# Altium schematic sheet Teensywpinsfinal.SchDoc
size C
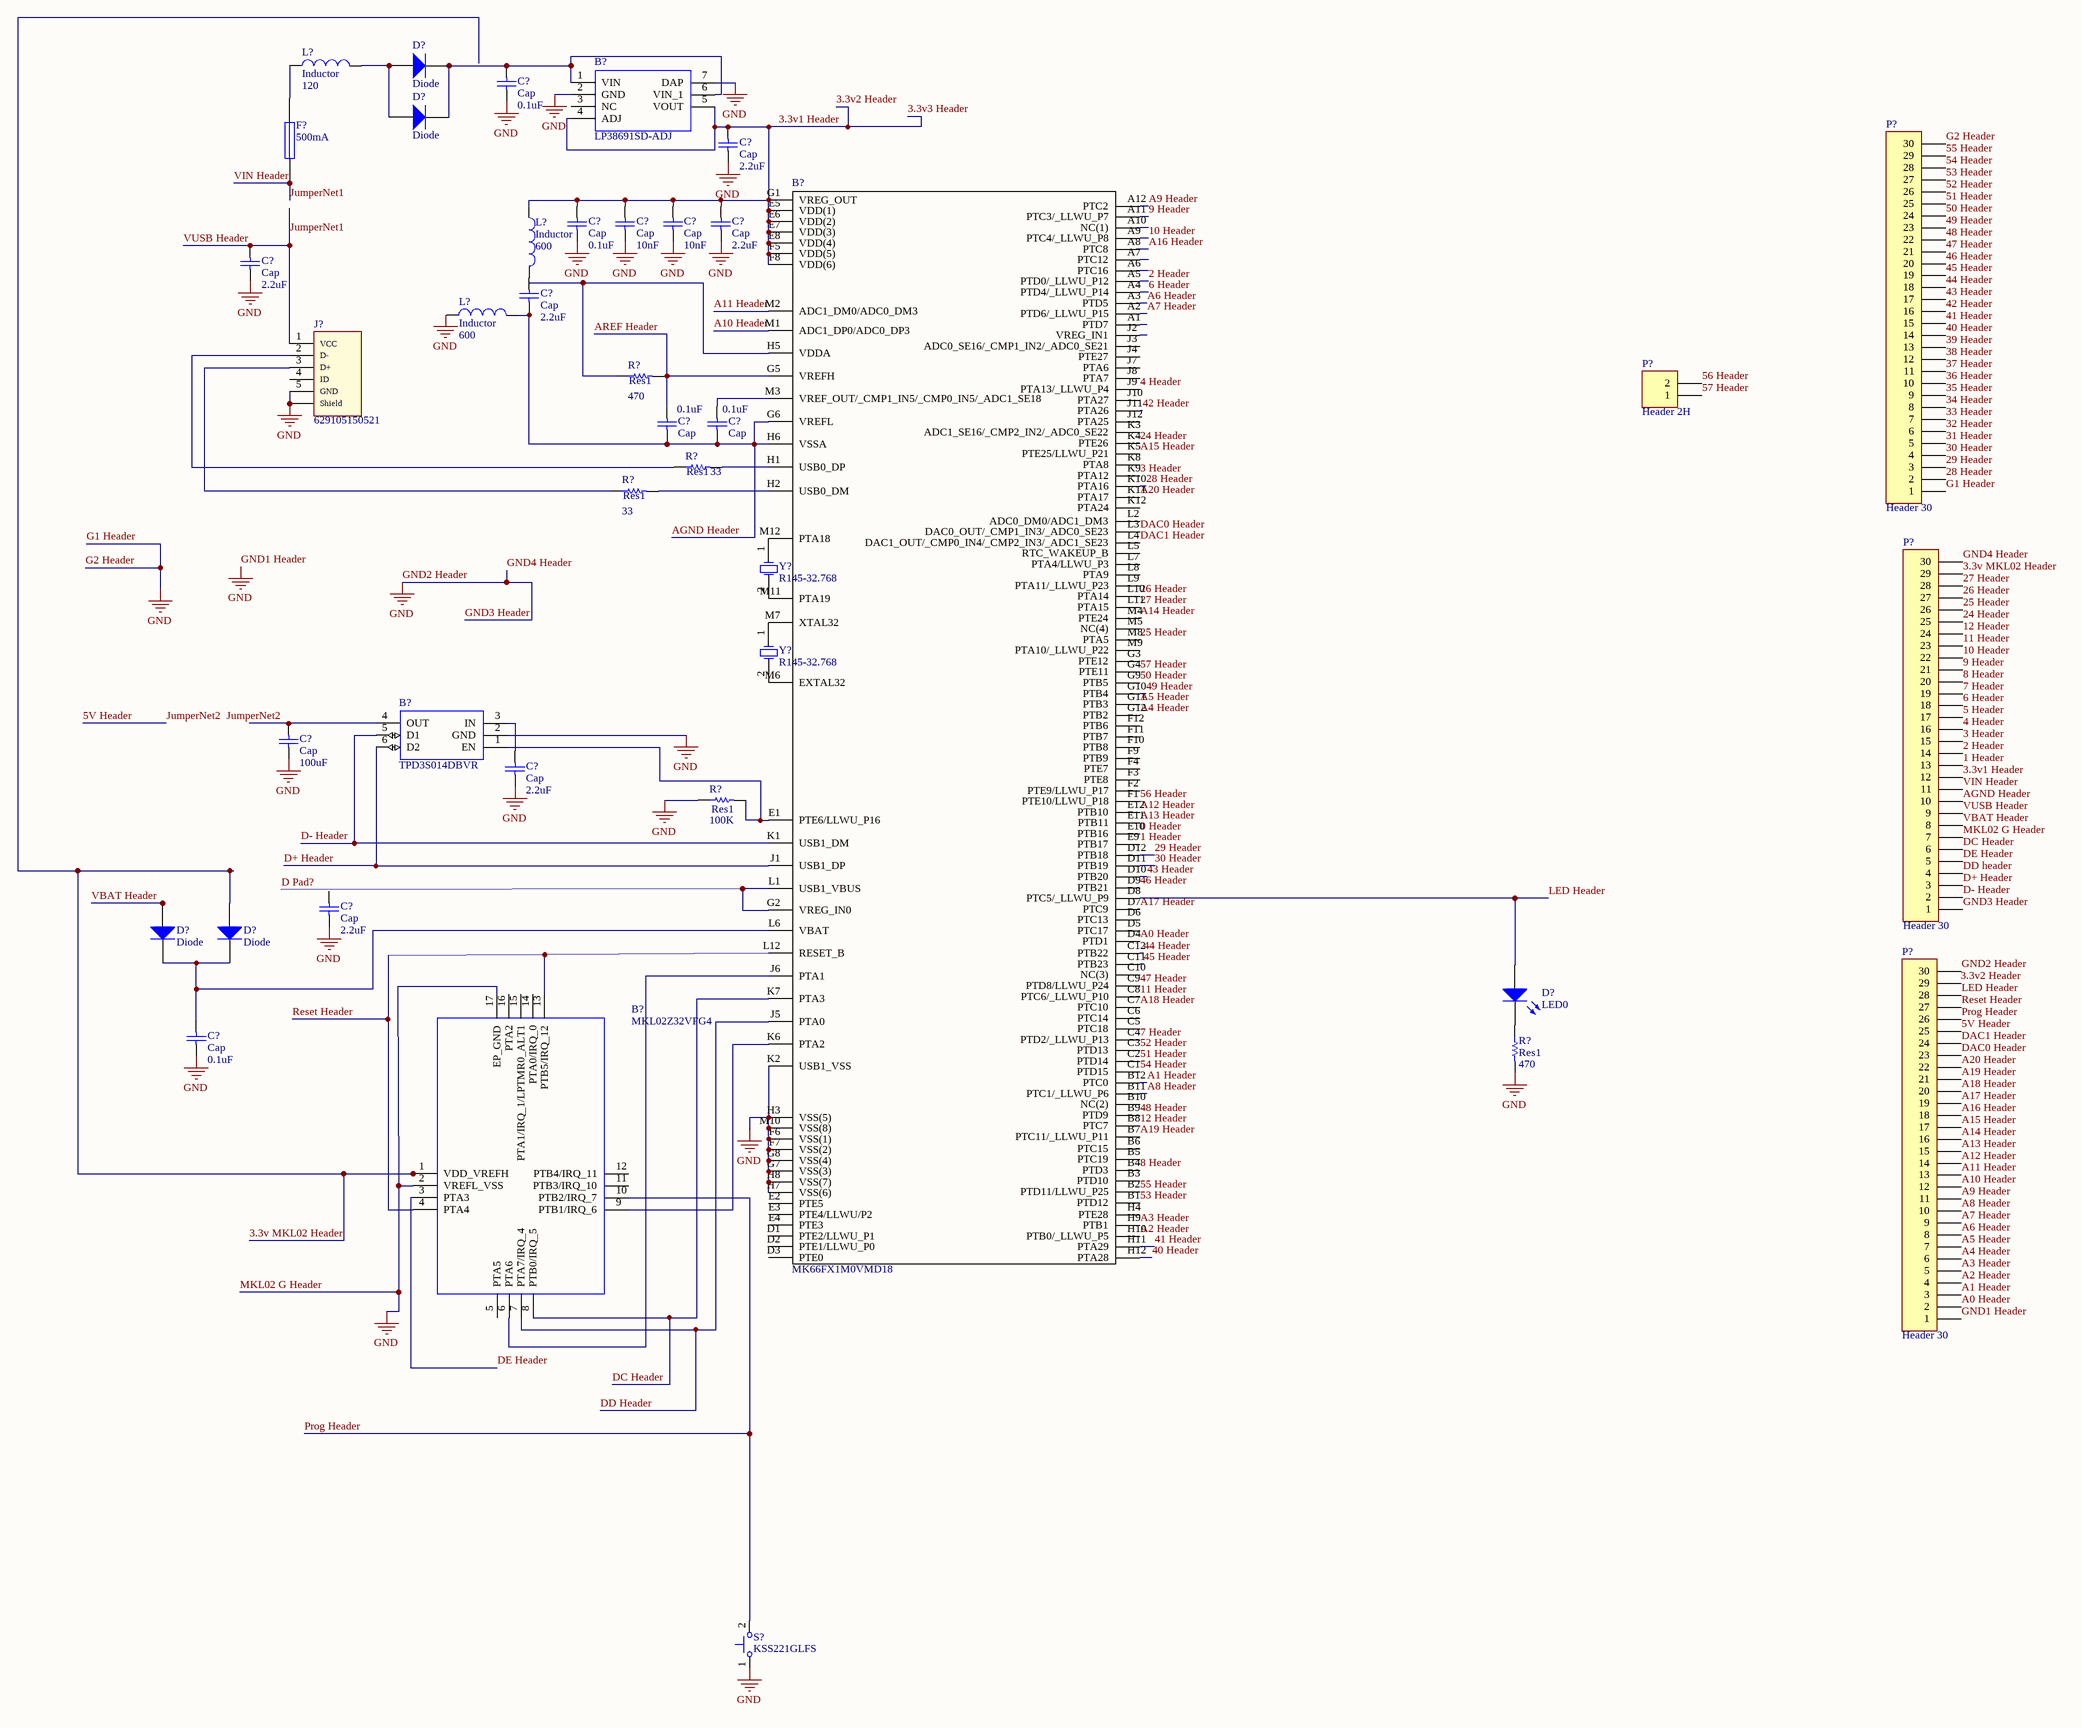
[diagram p0: Teensywpinsfinal.SchDoc]

## Parts
(Parts that share a designator on the sheet are numbered #1, #2 ... from top to bottom, then left to right.)
B?#1  LP38691SD-ADJ  [SON95P300X300X80-7N]
B?#2  TPD3S014DBVR  [SOT95P280X145-6N]
B?#3  MKL02Z32VFG4  [QFN50P300X300X65-17N-D]
B?#4  MK66FX1M0VMD18  [BGA144C100P12X12_1300X1300X170]
C?#1  Cap  value 0.1uF  [RAD-0.1]
C?#2  Cap  value 2.2uF  [RAD-0.1]
C?#3  Cap  value 0.1uF  [RAD-0.1]
C?#4  Cap  value 10nF  [RAD-0.1]
C?#5  Cap  value 10nF  [RAD-0.1]
C?#6  Cap  value 2.2uF  [RAD-0.1]
C?#7  Cap  value 2.2uF  [RAD-0.1]
C?#8  Cap  value 2.2uF  [RAD-0.1]
C?#9  Cap  value 0.1uF  [RAD-0.1]
C?#10  Cap  value 0.1uF  [RAD-0.1]
C?#11  Cap  value 100uF  [RAD-0.1]
C?#12  Cap  value 2.2uF  [RAD-0.1]
C?#13  Cap  value 2.2uF  [RAD-0.1]
C?#14  Cap  value 0.1uF  [RAD-0.1]
D?#1  Diode  [SMC]
D?#2  Diode  [SMC]
D?#3  Diode  [SMC]
D?#4  Diode  [SMC]
D?#5  LED0  [LED-0]
F?  500mA  [PIN-W2/E2.8]
J?  629105150521  [629105150521]
L?#1  Inductor  value 120  [0402-A]
L?#2  Inductor  value 600  [0402-A]
L?#3  Inductor  value 600  [0402-A]
P?#1  Header 2H  [HDR1X2H]
P?#2  Header 30  [HDR1X30]
P?#3  Header 30  [HDR1X30]
P?#4  Header 30  [HDR1X30]
R?#1  Res1  value 470  [AXIAL-0.3]
R?#2  Res1  value 33  [AXIAL-0.3]
R?#3  Res1  value 33  [AXIAL-0.3]
R?#4  Res1  value 100K  [AXIAL-0.3]
R?#5  Res1  value 470  [AXIAL-0.3]
S?  KSS221GLFS  [KSS-2G]
Y?#1  R145-32.768  [R145]
Y?#2  R145-32.768  [R145]

## Nets
G1 Header: B?#1.2(GND) B?#1.7(DAP) B?#2.2(GND) B?#3.2(VREFL_VSS) B?#3.17(EP_GND) B?#4.F6(VSS(1)) B?#4.F7(VSS(2)) B?#4.G7(VSS(3)) B?#4.G8(VSS(4)) B?#4.H3(VSS(5)) B?#4.H7(VSS(6)) B?#4.H8(VSS(7)) B?#4.K2(USB1_VSS) B?#4.M10(VSS(8)) C?#1.2 C?#2.2 C?#3.2 C?#4.2 C?#5.2 C?#6.2 C?#7.2 C?#11.2 C?#12.2 C?#13.2 C?#14.2 J?.5(GND) J?.Shell(Shield) L?#3.1 P?#2.1 P?#2.30 P?#3.1 P?#3.7 P?#3.30 P?#4.1 P?#4.30 R?#4.1 R?#5.2 S?.1  [also labelled G2 Header, GND, GND1 Header, GND2 Header, GND3 Header, GND4 Header, MKL02 G Header]
0 Header: B?#4.E10(PTB16)
1 Header: B?#4.E9(PTB17) P?#3.13
2 Header: B?#4.A5(PTD0/_LLWU_P12) P?#3.14
3 Header: B?#4.K9(PTA12) P?#3.15
3.3v1 Header: B?#1.4(ADJ) B?#1.5(VOUT) B?#4.E5(VDD(1)) B?#4.E6(VDD(2)) B?#4.E7(VDD(3)) B?#4.E8(VDD(4)) B?#4.F5(VDD(5)) B?#4.F8(VDD(6)) B?#4.G1(VREG_OUT) C?#2.1 C?#3.1 C?#4.1 C?#5.1 C?#6.1 L?#2.1 P?#3.12 P?#4.29  [also labelled 3.3v2 Header, 3.3v3 Header]
3.3v MKL02 Header: B?#3.1(VDD_VREFH) D?#4.1(A) P?#3.29
4 Header: B?#4.J9(PTA13/_LLWU_P4) P?#3.16
5 Header: P?#3.17
5V Header: P?#4.25  [also labelled JumperNet2]
6 Header: B?#4.A4(PTD4/_LLWU_P14) P?#3.18
7 Header: B?#4.C4(PTD2/_LLWU_P13) P?#3.19
8 Header: B?#4.B4(PTD3) P?#3.20
9 Header: B?#4.A11(PTC3/_LLWU_P7) P?#3.21
10 Header: B?#4.A9(PTC4/_LLWU_P8) P?#3.22
11 Header: B?#4.C8(PTC6/_LLWU_P10) P?#3.23
12 Header: B?#4.B8(PTC7) P?#3.24
24 Header: B?#4.K4(PTE26) P?#3.25
25 Header: B?#4.M8(PTA5) P?#3.26
26 Header: B?#4.L10(PTA14) P?#3.27
27 Header: B?#4.L11(PTA15) P?#3.28
28 Header: B?#4.K10(PTA16) P?#2.2
29 Header: B?#4.D12(PTB18) P?#2.3
30 Header: B?#4.D11(PTB19) P?#2.4
31 Header: P?#2.5
32 Header: P?#2.6
33 Header: P?#2.7
34 Header: P?#2.8
35 Header: P?#2.9
36 Header: P?#2.10
37 Header: P?#2.11
38 Header: P?#2.12
39 Header: P?#2.13
40 Header: B?#4.H12(PTA28) P?#2.14
41 Header: B?#4.H11(PTA29) P?#2.15
42 Header: B?#4.J11(PTA26) P?#2.16
43 Header: B?#4.D10(PTB20) P?#2.17
44 Header: B?#4.C12(PTB22) P?#2.18
45 Header: B?#4.C11(PTB23) P?#2.19
46 Header: B?#4.D9(PTB21) P?#2.20
47 Header: B?#4.C9(PTD8/LLWU_P24) P?#2.21
48 Header: B?#4.B9(PTD9) P?#2.22
49 Header: B?#4.G10(PTB4) P?#2.23
50 Header: B?#4.G9(PTB5) P?#2.24
51 Header: B?#4.C2(PTD14) P?#2.25
52 Header: B?#4.C3(PTD13) P?#2.26
53 Header: B?#4.B1(PTD12) P?#2.27
54 Header: B?#4.C1(PTD15) P?#2.28
55 Header: B?#4.B2(PTD11/LLWU_P25) P?#2.29
56 Header: B?#4.F1(PTE10/LLWU_P18) P?#1.2
57 Header: B?#4.G4(PTE11) P?#1.1
A0 Header: B?#4.D4(PTD1) P?#4.2
A1 Header: B?#4.B12(PTC0) P?#4.3
A2 Header: B?#4.H10(PTB0/_LLWU_P5) P?#4.4
A3 Header: B?#4.H9(PTB1) P?#4.5
A4 Header: B?#4.G12(PTB2) P?#4.6
A5 Header: B?#4.G11(PTB3) P?#4.7
A6 Header: B?#4.A3(PTD5) P?#4.8
A7 Header: B?#4.A2(PTD6/_LLWU_P15) P?#4.9
A8 Header: B?#4.B11(PTC1/_LLWU_P6) P?#4.10
A9 Header: B?#4.A12(PTC2) P?#4.11
A10 Header: B?#4.M1(ADC1_DP0/ADC0_DP3) P?#4.12
A11 Header: B?#4.M2(ADC1_DM0/ADC0_DM3) P?#4.13
A12 Header: B?#4.E12(PTB10) P?#4.14
A13 Header: B?#4.E11(PTB11) P?#4.15
A14 Header: B?#4.M4(PTE24) P?#4.16
A15 Header: B?#4.K5(PTE25/LLWU_P21) P?#4.17
A16 Header: B?#4.A8(PTC8) P?#4.18
A17 Header: B?#4.D7(PTC9) P?#4.19
A18 Header: B?#4.C7(PTC10) P?#4.20
A19 Header: B?#4.B7(PTC11/_LLWU_P11) P?#4.21
A20 Header: B?#4.K11(PTA17) P?#4.22
AGND Header: B?#4.G6(VREFL) B?#4.H6(VSSA) C?#8.2 C?#9.2 C?#10.2 L?#3.2 P?#3.10
AREF Header: B?#4.G5(VREFH) C?#9.1 R?#1.2
D Pad?: B?#4.G2(VREG_IN0) B?#4.L1(USB1_VBUS)
D+ Header: B?#2.6(D2) B?#4.J1(USB1_DP) P?#3.3
D- Header: B?#2.5(D1) B?#4.K1(USB1_DM) P?#3.2
DAC0 Header: B?#4.L3(DAC0_OUT/_CMP1_IN3/_ADC0_SE23) P?#4.23
DAC1 Header: B?#4.L4(DAC1_OUT/_CMP0_IN4/_CMP2_IN3/_ADC1_SE23) P?#4.24
DC Header: B?#3.8(PTB0/IRQ_5) B?#4.K7(PTA3) P?#3.6
DD Header: B?#3.7(PTA7/IRQ_4) B?#4.J5(PTA0) P?#3.4
DE Header: B?#3.3(PTA3) P?#3.5
JumperNet1: C?#7.1 F?.1 J?.1(VCC) P?#3.9 P?#3.11  [also labelled VIN Header, VUSB Header]
LED Header: B?#4.D8(PTC5/_LLWU_P9) D?#5.1(A) P?#4.28
Prog Header: B?#3.10(PTB2/IRQ_7) P?#4.26 S?.2
Reset Header: B?#3.4(PTA4) B?#3.13(PTB5/IRQ_12) B?#4.L12(RESET_B) P?#4.27
VBAT Header: D?#3.1(A) P?#3.8
NetB?#1_1: B?#1.1(VIN) B?#1.6(VIN_1) C?#1.1 D?#1.2(K) D?#2.2(K)
NetB?#2_1: B?#2.1(EN) B?#4.E1(PTE6/LLWU_P16) R?#4.2
NetB?#2_3: B?#2.3(IN) C?#12.1
NetB?#2_4: B?#2.4(OUT) C?#11.1
NetB?#3_6: B?#3.6(PTA6) B?#4.J6(PTA1)
NetB?#3_9: B?#3.9(PTB1/IRQ_6) B?#4.K6(PTA2)
NetB?#4_H1: B?#4.H1(USB0_DP) R?#2.2
NetB?#4_H2: B?#4.H2(USB0_DM) R?#3.2
NetB?#4_H5: B?#4.H5(VDDA) R?#1.1
NetB?#4_L6: B?#4.L6(VBAT) C?#14.1 D?#3.2(K) D?#4.2(K)
NetB?#4_M3: B?#4.M3(VREF_OUT/_CMP1_IN5/_CMP0_IN5/_ADC1_SE18) C?#10.1
NetB?#4_M6: B?#4.M6(EXTAL32) Y?#2.2(OSC2)
NetB?#4_M7: B?#4.M7(XTAL32) Y?#2.1(OSC1)
NetB?#4_M11: B?#4.M11(PTA19) Y?#1.2(OSC2)
NetB?#4_M12: B?#4.M12(PTA18) Y?#1.1(OSC1)
NetC?#8_1: C?#8.1 L?#2.2
NetD?#1_1: D?#1.1(A) D?#2.1(A) L?#1.2
NetD?#5_2: D?#5.2(K) R?#5.1
NetF?_2: F?.2 L?#1.1
NetJ?_2: J?.2(D-) R?#2.1
NetJ?_3: J?.3(D+) R?#3.1

Not connected (* = marked no-connect by the designer): B?#1 3(NC); B?#3 5(PTA5) 11(PTB3/IRQ_10) 12(PTB4/IRQ_11) 14(PTA0/IRQ_0) 15(PTA1/IRQ_1/LPTMR0_ALT1) 16(PTA2); B?#4 A1(PTD7) A6(PTC16) A7(PTC12) A10(NC(1)) B3(PTD10) B5(PTC19) B6(PTC15) B10(NC(2)) C5(PTC18) C6(PTC14) C10(NC(3)) D1(PTE2/LLWU_P1) D2(PTE1/LLWU_P0) D3(PTE0) D5(PTC17) D6(PTC13) E2(PTE5) E3(PTE4/LLWU/P2) E4(PTE3) F2(PTE9/LLWU_P17) F3(PTE8) F4(PTE7) F9(PTB9) F10(PTB8) F11(PTB7) F12(PTB6) G3(PTE12) H4(PTE28) J2(VREG_IN1) J3(ADC0_SE16/_CMP1_IN2/_ADC0_SE21) J4(PTE27) J7(PTA6) J8(PTA7) J10(PTA27) J12(PTA25) K3(ADC1_SE16/_CMP2_IN2/_ADC0_SE22) K8(PTA8) K12(PTA24) L2(ADC0_DM0/ADC1_DM3) L5(RTC_WAKEUP_B) L7(PTA4/LLWU_P3) L8(PTA9) L9(PTA11/_LLWU_P23) M5(NC(4)) M9(PTA10/_LLWU_P22); C?#13 1; J? 4(ID)

## Notes on the sheet
- Labels drawn without touching a wire or pin: JumperNet2

## Library data of the parts
B?#1 = LP38691SD-ADJ: 500mA LDO Regulator Adj.,LP38691SD-ADJ; Manufacturer_Name: Texas Instruments; Geometry.Height: 0.8mm; Supplier_Name: Mouser; Mouser Part Number: 926-LP38691SD-ADJ; Manufacturer_Part_Number: LP38691SD-ADJ; Datasheet Link: http://www.ti.com/lit/ds/symlink/lp38691-adj.pdf; 3D Package: *
B?#2 = TPD3S014DBVR: Current Limit Load Sw & TVS 0.5A SOT23-6 Texas Instruments TPD3S014DBVR Load Switch IC, Current Limit Switch, 4.5  5.5V, 6-Pin, SOT-23; Geometry.Height: 1.45mm; Supplier_Name: RS; RS Part Number: 9009703P; Manufacturer_Name: Texas Instruments; Manufacturer_Part_Number: TPD3S014DBVR; Allied_Number: *; Other Part Number: *; Datasheet Link: http://www.ti.com/lit/ds/symlink/tpd3s044.pdf; 3D Package: *
B?#3 = MKL02Z32VFG4: Freescale MKL02Z32VFG4, 32bit ARM Cortex M0 Microcontroller, 48MHz, 32 kB Flash, 16-Pin QFN; Manufacturer_Name: Nexperia; Geometry.Height: 0.65mm; Supplier_Name: RS; RS Part Number: 7884723; Manufacturer_Part_Number: MKL02Z32VFG4; Allied_Number: *; Other Part Number: *; Datasheet Link: http://cache.nxp.com/files/32bit/doc/data_sheet/KL02P32M48SF0.pdf; 3D Package: *
B?#4 = MK66FX1M0VMD18: ARM Microcontrollers - MCU BL Microcontrollers; Manufacturer_Name: Nexperia; Geometry.Height: 1.7mm; Supplier_Name: RS; RS Part Number: *; Manufacturer_Part_Number: MK66FX1M0VMD18; Allied_Number: *; Other Part Number: *; Datasheet Link: http://cache.freescale.com/files/shared/doc/package_info/98ASA00222D.pdf; 3D Package: *
C?#1-C?#14 = Cap: Capacitor; Published: 8-Jun-2000; LatestRevisionDate: 17-Jul-2002; LatestRevisionNote: Re-released for DXP Platform.; PackageReference: RAD-0.3; Publisher: Altium Limited; PackageDescription: Radial Cap, Thru-Hole; 2 Leads; 0.3 in Pin Spacing
D?#1-D?#4 = Diode: Default Diode; Published: 8-Jun-2000; LatestRevisionDate: 17-Jul-2002; LatestRevisionNote: Re-released for DXP Platform.; PackageVersion: Sep-1996; PackageReference: SMC; Publisher: Altium Limited; PackageDescription: DO-214-AB/SMC; 2 C-Bend Leads; Body 7.9 x 5.9 mm, inc. leads (LxW); Code_JEDEC: DO-214-AB
D?#5 = LED0: Typical INFRARED GaAs LED; Published: 8-Jun-2000; LatestRevisionDate: 08-Jul-2005; LatestRevisionNote: Mech Layer 1 removed.; PackageReference: LED-0; Publisher: Altium Limited; PackageDescription: LED; 2 Leads
F? = Fuse 1: Fuse; Published: 8-Jun-2000; LatestRevisionDate: 17-Jul-2002; LatestRevisionNote: Re-released for DXP Platform.; PackageReference: PIN-W2/E2.8; Publisher: Altium Limited; PackageDescription: Thru-Hole; 2 Leads
J? = 629105150521: Micro USB 2.0 SMT Type B Horizontal 5 Contacts High Current WR-COM; Interface Type: Type B; Gender: Receptacle; ComponentLink1Description: Manufacturer; ComponentLink1URL: http://www.we-online.de; ComponentLink2Description: Datasheet; ComponentLink2URL: http://katalog.we-online.de/em/datasheet/629105150521.pdf; Part Number: 629105150521; Published Date: April 2017; Publisher: Wurth Elektronik; Sub-Family: Micro USB 2.0; Type: Horizontal; Construction: SMT
L?#1-L?#3 = Inductor: Code_IEC: 1005; Published: 8-Jun-2000; LatestRevisionDate: 29-May-2009; LatestRevisionNote: IPC-7351 Footprint Added.; PackageReference: 0402-A; Publisher: Altium Limited; PackageDescription: Chip Inductor; Code_JEITA: 0402
P?#1 = Header 2H: Header, 2-Pin, Right Angle; LatestRevisionDate: 17-Jul-2002; LatestRevisionNote: Re-released for DXP Platform.; Publisher: Altium Limited
P?#2-P?#4 = Header 30: Header, 30-Pin; LatestRevisionDate: 17-Jul-2002; LatestRevisionNote: Re-released for DXP Platform.; Publisher: Altium Limited
R?#1-R?#5 = Res1: Resistor; Published: 8-Jun-2000; LatestRevisionDate: 17-Jul-2002; LatestRevisionNote: Re-released for DXP Platform.; PackageReference: AXIAL-0.3; Publisher: Altium Limited; PackageDescription: Axial Device, Thru-Hole; 2 Leads; 0.3 in Pin Spacing
S? = KSS221GLFS: Switch, Subminiature Side-Actuated Tact, SMT, KSS Series, Std Actuator, 2 Gull Wing Leads, SPST, 2N Force, Silver Contact; PCB_Layout: Complies with manufacturer's recommendation.; Published: 14-Mar-2008; DatasheetVersion: Aug-2007; PackageVersion: Aug-2007; PackageReference: KSS-2G; Publisher: Altium Limited; PackageDescription: Subminiature SMT Side Actuated Switch, Body 7 x 3.5 mm (LxW); ComponentLink1Description: Manufacturer Link; ComponentLink1URL: http://www.ck-components.com/; ComponentLink2Description: Datasheet; ComponentLink2URL: http://www.ck-components.com/media/pdf/catalogs/Tactile_Switches%5CKSS_series_Tactile_August_2007.pdf
Y?#1 Y?#2 = R145-32.768: Tuning Fork Crystal Unit; Published: 8-Jun-2000; LatestRevisionDate: 17-Jul-2002; LatestRevisionNote: Re-released for DXP Platform.; DatasheetDocument: 28-Sep-1998; PackageReference: R145; Publisher: Altium Limited; ComponentLink1Description: Manufacturer Link; ComponentLink1URL: http://www.raltron.com/products/microcrystals/default.asp; ComponentLink2Description: Datasheet; ComponentLink2URL: http://www.raltron.com/products/pdfspecs/crystal_r38_26_145.pdf